# Altium project ADH_XC7Z010_SoC.PrjPcb (part 10 of 10)

## Sheet Gigabit_Ethernet.SchDoc: Gigabit Ethernet
size A3; DrawnBy: Emre Can Damyanlı; Revision: A.1; SheetNumber: 9; SheetTotal: 9; ENG_APP_DATE: --/--/--; DSN_APP_DATE: --/--/--; CHK_APP_DATE: --/--/--
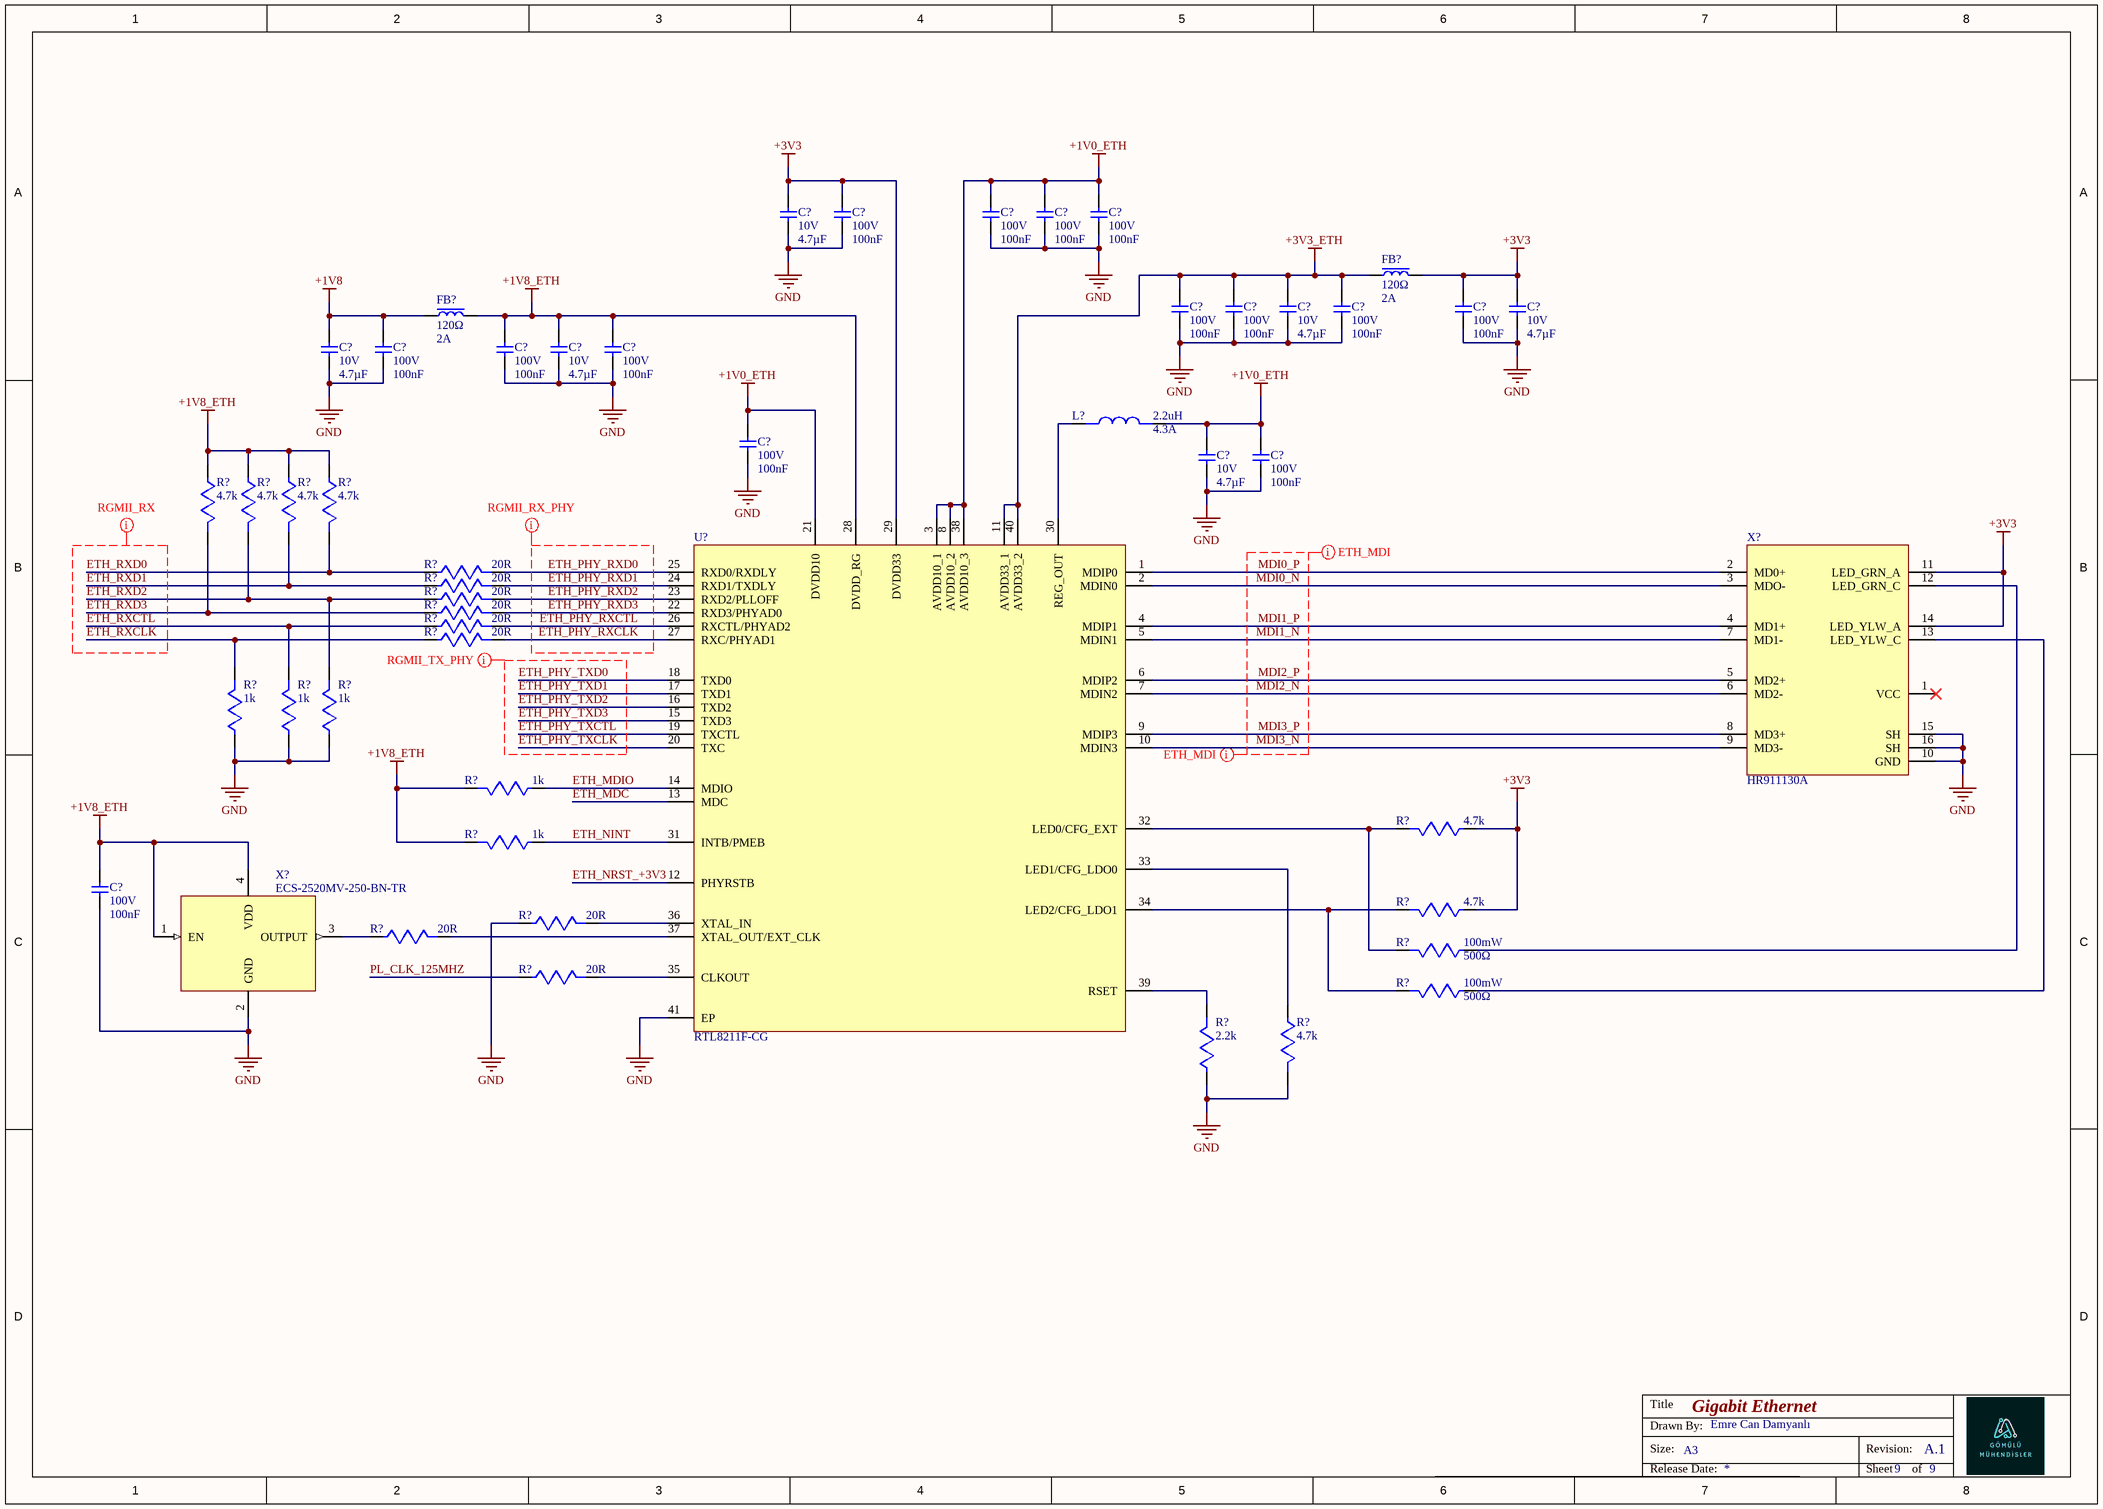
[diagram p8: Gigabit_Ethernet.SchDoc]

### Parts
(Parts that share a designator on the sheet are numbered #1, #2 ... from top to bottom, then left to right.)
C?#187  value 100nF  Voltage Rating: 100V  [CAPC1608X94N]  (hidden comment: GCJ188R72A104KA01D)
C?#188  value 100nF  Voltage Rating: 100V  [CAPC1608X94N]  (hidden comment: GCJ188R72A104KA01D)
C?#189  value 100nF  Voltage Rating: 100V  [CAPC1608X94N]  (hidden comment: GCJ188R72A104KA01D)
C?#190  value 100nF  Voltage Rating: 100V  [CAPC1608X94N]  (hidden comment: GCJ188R72A104KA01D)
C?#191  value 4.7µF  Voltage Rating: 10V  [CAPC1005X55N]  (hidden comment: CL05A475MP5NRNC)
C?#192  value 100nF  Voltage Rating: 100V  [CAPC1608X94N]  (hidden comment: GCJ188R72A104KA01D)
C?#193  value 100nF  Voltage Rating: 100V  [CAPC1608X94N]  (hidden comment: GCJ188R72A104KA01D)
C?#194  value 100nF  Voltage Rating: 100V  [CAPC1608X94N]  (hidden comment: GCJ188R72A104KA01D)
C?#195  value 100nF  Voltage Rating: 100V  [CAPC1608X94N]  (hidden comment: GCJ188R72A104KA01D)
C?#196  value 4.7µF  Voltage Rating: 10V  [CAPC1005X55N]  (hidden comment: CL05A475MP5NRNC)
C?#197  value 4.7µF  Voltage Rating: 10V  [CAPC1005X55N]  (hidden comment: CL05A475MP5NRNC)
C?#198  value 100nF  Voltage Rating: 100V  [CAPC1608X94N]  (hidden comment: GCJ188R72A104KA01D)
C?#199  value 100nF  Voltage Rating: 100V  [CAPC1608X94N]  (hidden comment: GCJ188R72A104KA01D)
C?#200  value 100nF  Voltage Rating: 100V  [CAPC1608X94N]  (hidden comment: GCJ188R72A104KA01D)
C?#201  value 4.7µF  Voltage Rating: 10V  [CAPC1005X55N]  (hidden comment: CL05A475MP5NRNC)
C?#202  value 4.7µF  Voltage Rating: 10V  [CAPC1005X55N]  (hidden comment: CL05A475MP5NRNC)
C?#203  value 100nF  Voltage Rating: 100V  [CAPC1608X94N]  (hidden comment: GCJ188R72A104KA01D)
C?#204  value 100nF  Voltage Rating: 100V  [CAPC1608X94N]  (hidden comment: GCJ188R72A104KA01D)
C?#205  value 4.7µF  Voltage Rating: 10V  [CAPC1005X55N]  (hidden comment: CL05A475MP5NRNC)
C?#206  value 100nF  Voltage Rating: 100V  [CAPC1608X94N]  (hidden comment: GCJ188R72A104KA01D)
FB?#5  Impedance: 120Ω  Max Current Rating: 2A  [FERRITE_0402]  (hidden comment: BLM15PX121SN1D)
FB?#6  Impedance: 120Ω  Max Current Rating: 2A  [FERRITE_0402]  (hidden comment: BLM15PX121SN1D)
L?#5  value 2.2uH  RMS Current (Irms): 4.3A  [PA4332.XXXNLT]  (hidden comment: PA4332.222NLT)
R?#136  value 4.7k  [RESISTOR_0603]  (hidden comment: RC0603FR-074K7L)
R?#137  value 4.7k  [RESISTOR_0603]  (hidden comment: RC0603FR-074K7L)
R?#138  value 4.7k  [RESISTOR_0603]  (hidden comment: RC0603FR-074K7L)
R?#139  value 4.7k  [RESISTOR_0603]  (hidden comment: RC0603FR-074K7L)
R?#140  value 20R  (hidden comment: RC0603FR-0720RL)
R?#141  value 20R  (hidden comment: RC0603FR-0720RL)
R?#142  value 20R  (hidden comment: RC0603FR-0720RL)
R?#143  value 20R  (hidden comment: RC0603FR-0720RL)
R?#144  value 20R  (hidden comment: RC0603FR-0720RL)
R?#145  value 20R  (hidden comment: RC0603FR-0720RL)
R?#146  value 1k  [RESISTOR_0603]  (hidden comment: RC0603FR-071KL)
R?#147  value 1k  [RESISTOR_0603]  (hidden comment: RC0603FR-071KL)
R?#148  value 1k  [RESISTOR_0603]  (hidden comment: RC0603FR-071KL)
R?#149  value 1k  [RESISTOR_0603]  (hidden comment: RC0603FR-071KL)
R?#150  value 4.7k  [RESISTOR_0603]  (hidden comment: RC0603FR-074K7L)
R?#151  value 1k  [RESISTOR_0603]  (hidden comment: RC0603FR-071KL)
R?#152  value 4.7k  [RESISTOR_0603]  (hidden comment: RC0603FR-074K7L)
R?#153  value 20R  (hidden comment: RC0603FR-0720RL)
R?#154  value 20R  (hidden comment: RC0603FR-0720RL)
R?#155  value 500Ω  Power Rating: 100mW  [RESISTOR_0603]  (hidden comment: RT0603BRC07500RL)
R?#156  value 20R  (hidden comment: RC0603FR-0720RL)
R?#157  value 500Ω  Power Rating: 100mW  [RESISTOR_0603]  (hidden comment: RT0603BRC07500RL)
R?#158  value 2.2k  [RESISTOR_0603]  (hidden comment: RC0603FR-072K2L)
R?#159  value 4.7k  [RESISTOR_0603]  (hidden comment: RC0603FR-074K7L)
U?#27  RTL8211F-CG  [QFN40P500X500X90-41N-D]
X?#3  HR911130A  [HR911130A]
X?#4  ECS-2520MV-250-BN-TR  [OSCCC250X200X90N]

### Nets
+1V0_ETH: C?#188.2 C?#189.2 C?#190.2 C?#203.2 C?#204.2 C?#205.2 L?#5.2 U?#27.3(AVDD10_1) U?#27.8(AVDD10_2) U?#27.21(DVDD10) U?#27.38(AVDD10_3)
+1V8: C?#198.2 C?#201.2 FB?#6.1
+1V8_ETH: C?#199.2 C?#200.2 C?#202.2 C?#206.2 FB?#6.2 R?#136.1 R?#137.1 R?#138.1 R?#139.1 R?#149.2 R?#151.2 U?#27.28(DVDD_RG) X?#4.1(EN) X?#4.4(VDD)
+3V3: C?#187.2 C?#191.2 C?#195.2 C?#197.2 FB?#5.1 R?#150.1 R?#152.1 U?#27.29(DVDD33) X?#3.11(LED_GRN_A) X?#3.14(LED_YLW_A)
+3V3_ETH: C?#192.2 C?#193.2 C?#194.2 C?#196.2 FB?#5.2 U?#27.11(AVDD33_1) U?#27.40(AVDD33_2)
GND: C?#187.1 C?#188.1 C?#189.1 C?#190.1 C?#191.1 C?#192.1 C?#193.1 C?#194.1 C?#195.1 C?#196.1 C?#197.1 C?#198.1 C?#199.1 C?#200.1 C?#201.1 C?#202.1 C?#203.1 C?#204.1 C?#205.1 C?#206.1 R?#146.1 R?#147.1 R?#148.1 R?#153.1 R?#158.1 R?#159.2 U?#27.41(EP) X?#3.10(GND) X?#3.15(SH) X?#3.16(SH) X?#4.2(GND)
ETH_MDC: U?#27.13(MDC)
ETH_MDIO: R?#149.1 U?#27.14(MDIO)
ETH_NINT: R?#151.1 U?#27.31(INTB/PMEB)
ETH_NRST_+3V3: U?#27.12(PHYRSTB)
ETH_PHY_RXCLK: R?#145.2 U?#27.27(RXC/PHYAD1)
ETH_PHY_RXCTL: R?#144.2 U?#27.26(RXCTL/PHYAD2)
ETH_PHY_RXD0: R?#140.2 U?#27.25(RXD0/RXDLY)
ETH_PHY_RXD1: R?#141.2 U?#27.24(RXD1/TXDLY)
ETH_PHY_RXD2: R?#142.2 U?#27.23(RXD2/PLLOFF)
ETH_PHY_RXD3: R?#143.2 U?#27.22(RXD3/PHYAD0)
ETH_PHY_TXCLK: U?#27.20(TXC)
ETH_PHY_TXCTL: U?#27.19(TXCTL)
ETH_PHY_TXD0: U?#27.18(TXD0)
ETH_PHY_TXD1: U?#27.17(TXD1)
ETH_PHY_TXD2: U?#27.16(TXD2)
ETH_PHY_TXD3: U?#27.15(TXD3)
ETH_RXCLK: R?#145.1 R?#146.2
ETH_RXCTL: R?#144.1 R?#147.2
ETH_RXD0: R?#139.2 R?#140.1
ETH_RXD1: R?#138.2 R?#141.1
ETH_RXD2: R?#137.2 R?#142.1 R?#148.2
ETH_RXD3: R?#136.2 R?#143.1
MDI0_N: U?#27.2(MDIN0) X?#3.3(MDO-)
MDI0_P: U?#27.1(MDIP0) X?#3.2(MD0+)
MDI1_N: U?#27.5(MDIN1) X?#3.7(MD1-)
MDI1_P: U?#27.4(MDIP1) X?#3.4(MD1+)
MDI2_N: U?#27.7(MDIN2) X?#3.6(MD2-)
MDI2_P: U?#27.6(MDIP2) X?#3.5(MD2+)
MDI3_N: U?#27.10(MDIN3) X?#3.9(MD3-)
MDI3_P: U?#27.9(MDIP3) X?#3.8(MD3+)
PL_CLK_125MHZ: R?#156.1
NetL?#5_1: L?#5.1 U?#27.30(REG_OUT)
NetR?#150_2: R?#150.2 R?#155.2 U?#27.32(LED0/CFG_EXT)
NetR?#152_2: R?#152.2 R?#157.2 U?#27.34(LED2/CFG_LDO1)
NetR?#153_2: R?#153.2 U?#27.36(XTAL_IN)
NetR?#154_1: R?#154.1 X?#4.3(OUTPUT)
NetR?#154_2: R?#154.2 U?#27.37(XTAL_OUT/EXT_CLK)
NetR?#155_1: R?#155.1 X?#3.12(LED_GRN_C)
NetR?#156_2: R?#156.2 U?#27.35(CLKOUT)
NetR?#157_1: R?#157.1 X?#3.13(LED_YLW_C)
NetR?#158_2: R?#158.2 U?#27.39(RSET)
NetR?#159_1: R?#159.1 U?#27.33(LED1/CFG_LDO0)

Not connected (* = marked no-connect by the designer): X?#3 1(VCC)*

### Layout directives
mark named ETH_MDI: MDI0_N, MDI0_P, MDI1_N, MDI1_P, MDI2_N, MDI2_P, MDI3_N, MDI3_P
differential pair: MDI0_N, MDI0_P, MDI1_N, MDI1_P, MDI2_N, MDI2_P, MDI3_N, MDI3_P
mark named RGMII_RX: ETH_RXCLK, ETH_RXCTL, ETH_RXD0, ETH_RXD1, ETH_RXD2, ETH_RXD3
mark named RGMII_RX_PHY: ETH_PHY_RXCLK, ETH_PHY_RXCTL, ETH_PHY_RXD0, ETH_PHY_RXD1, ETH_PHY_RXD2, ETH_PHY_RXD3
mark named RGMII_TX_PHY: ETH_PHY_TXCLK, ETH_PHY_TXCTL, ETH_PHY_TXD0, ETH_PHY_TXD1, ETH_PHY_TXD2, ETH_PHY_TXD3

### Notes on the sheet
- Title
- Size:
- Drawn By:
- A3
- Revision:
- Release Date:
- Sheet
- of

### Library data of the parts
C?#187-C?#190 C?#192-C?#195 C?#198-C?#200 C?#203 C?#204 C?#206 = GCJ188R72A104KA01D: as C?#116-C?#122 on sheet Zynq_PS_System; Supplier: Digikey; Supplier Part Number: 490-13420-1-ND; Manufacturer Part Number: GCJ188R72A104KA01D; RoHS: Yes; Category: Ceramic Capacitors; Stock: 681954; Pricing: 1=0,19, 10=0,123, 50=0,0774, 100=0,0619, 500=0,04472, 1000=0,03956 (USD); Mounting Technology: Surface Mount; Case/Package: 0603; Case Code (Metric): 1608; Case Code (Imperial): 0603; Min Operating Temperature: -55°C; Max Operating Temperature: 125°C; Packaging: Cut Tape; Tolerance: 10%; Features: Soft Termination; Series: GCJ; Length: 0.063inch; Width: 0.031inch; Height: 900um; Thickness: 0.035inch; Ratings: AEC-Q200; RoHS Compliant: Yes; Lead Free: 5697LeadFree; ComponentLink1URL: https://datasheet.octopart.com/GCJ188R72A104KA01D-Murata-datasheet-78375067.pdf?src-supplier=Future+Electronics; ComponentLink1Description: https://datasheet.octopart.com/GCJ188R72A104KA01D-Murata-datasheet-78375067.pdf?src-supplier=Future+Electronics; ComponentLink2URL: http://search.murata.co.jp/Ceramy/image/img/A01X/partnumbering_e_02.pdf?src-supplier=Digikey; ComponentLink2Description: http://search.murata.co.jp/Ceramy/image/img/A01X/partnumbering_e_02.pdf?src-supplier=Digikey; ComponentLink3URL: https://www.murata.com/~/media/webrenewal/support/library/catalog/products/capacitor/mlcc/c03e.ashx?la=en-us&src-supplier=Digikey; ComponentLink3Description: https://www.murata.com/~/media/webrenewal/support/library/catalog/products/capacitor/mlcc/c03e.ashx?la=en-us&src-supplier=Digikey; ComponentLink4URL: https://datasheet.octopart.com/GCJ188R72A104KA01D-Murata-datasheet-165611796.pdf?src-supplier=TME; ComponentLink4Description: https://datasheet.octopart.com/GCJ188R72A104KA01D-Murata-datasheet-165611796.pdf?src-supplier=TME
C?#191 C?#196 C?#197 C?#201 C?#202 C?#205 = CL05A475MP5NRNC: as C?#123-C?#125 on sheet Zynq_PS_System; Supplier: Avnet; Supplier Part Number: CL05A475MP5NRNC; Manufacturer Part Number: CL05A475MP5NRNC; RoHS: Compliant; Category: Ceramic Capacitors; Stock: 40000; Pricing: 10000=0,00671, 20000=0,00663, 40000=0,0066, 80000=0,00656, 160000=0,00653 (USD); Case/Package: 0402; Case Code (Imperial): 0402; Case Code (Metric): 1005; China RoHS: Compliant; Dielectric: X5R; Dielectric Material: Ceramic; Height: 500µm; Lead Free: Lead Free; Length: 1mm; Lifecycle Status: Production; Material: Ceramic; Max Operating Temperature: 85°C; Min Operating Temperature: -55°C; Mounting Technology: Surface Mount; Number of Terminals: 2; REACH SVHC: Yes; Schedule B: 8532240020, 8532240020|8532240020|8532240020|8532240020|8532240020|8532240020|8532240020|8532240020|8532240020|8532240020|8532240020|8532240020|8532240020|8532240020|8532240020|8532240020|8532240020|8532240020|8532240020|8532240020|8532240020|8532240020, 8532240020|8532240020|8532240020|8532240020|8532240020|8532240020|8532240020|8532240020|8532240020|8532240020|8532240020|8532240020|8532240020|8532240020|8532240020|8532240020|8532240020|8532240020|8532240020|8532240020|8532240020|8532240020|8532240020, 8532240020|8532240020|8532240020|8532240020|8532240020|8532240020|8532240020|8532240020|8532240020|8532240020|8532240020|8532240020|8532240020|8532240020|8532240020|8532240020|8532240020|8532240020|8532240020|8532240020|8532240020|8532240020|8532240020|85; Thickness: 558.8µm; Tolerance: 20%; Voltage Rating (DC): 10V; Width: 500µm; ComponentLink1URL: https://datasheet.octopart.com:443/CL05A475MP5NRNC-Samsung-Electro-Mechanics-datasheet-181551186.pdf?src-supplier=Newark; ComponentLink1Description: https://datasheet.octopart.com:443/CL05A475MP5NRNC-Samsung-Electro-Mechanics-datasheet-181551186.pdf?src-supplier=Newark; ComponentLink2URL: https://datasheet.octopart.com:443/CL05A475MP5NRNC-Samsung-Electro-Mechanics-datasheet-136482298.pdf?src-supplier=Newark; ComponentLink2Description: https://datasheet.octopart.com:443/CL05A475MP5NRNC-Samsung-Electro-Mechanics-datasheet-136482298.pdf?src-supplier=Newark; ComponentLink3URL: https://datasheet.octopart.com:443/CL05A475MP5NRNC-Samsung-Electro-Mechanics-datasheet-136031736.pdf?src-supplier=Future+Electronics; ComponentLink3Description: https://datasheet.octopart.com:443/CL05A475MP5NRNC-Samsung-Electro-Mechanics-datasheet-136031736.pdf?src-supplier=Future+Electronics; ComponentLink4URL: https://datasheet.octopart.com:443/CL05A475MP5NRNC-Samsung-Electro-Mechanics-datasheet-110226226.pdf?src-supplier=Future+Electronics; ComponentLink4Description: https://datasheet.octopart.com:443/CL05A475MP5NRNC-Samsung-Electro-Mechanics-datasheet-110226226.pdf?src-supplier=Future+Electronics; ComponentLink5URL: https://datasheet.octopart.com:443/CL05A475MP5NRNC-Samsung-Electro-Mechanics-datasheet-87580058.pdf?src-supplier=Future+Electronics; ComponentLink5Description: https://datasheet.octopart.com:443/CL05A475MP5NRNC-Samsung-Electro-Mechanics-datasheet-87580058.pdf?src-supplier=Future+Electronics; ComponentLink6URL: https://datasheet.octopart.com:443/CL05A475MP5NRNC-Samsung-Electro-Mechanics-datasheet-81461611.pdf?src-supplier=Future+Electronics; ComponentLink6Description: https://datasheet.octopart.com:443/CL05A475MP5NRNC-Samsung-Electro-Mechanics-datasheet-81461611.pdf?src-supplier=Future+Electronics; ComponentLink7URL: https://datasheet.octopart.com:443/CL05A475MP5NRNC-Samsung-datasheet-48647200.pdf?src-supplier=Future+Electronics; ComponentLink7Description: https://datasheet.octopart.com:443/CL05A475MP5NRNC-Samsung-datasheet-48647200.pdf?src-supplier=Future+Electronics; ComponentLink8URL: https://datasheet.octopart.com:443/CL05A475MP5NRNC-Samsung-datasheet-34153549.pdf?src-supplier=Future+Electronics; ComponentLink8Description: https://datasheet.octopart.com:443/CL05A475MP5NRNC-Samsung-datasheet-34153549.pdf?src-supplier=Future+Electronics; ComponentLink9URL: https://datasheet.octopart.com:443/CL05A475MP5NRNC-Samsung-datasheet-26589015.pdf?src-supplier=Future+Electronics; ComponentLink9Description: https://datasheet.octopart.com:443/CL05A475MP5NRNC-Samsung-datasheet-26589015.pdf?src-supplier=Future+Electronics; ComponentLink10URL: https://datasheet.octopart.com:443/CL05A475MP5NRNC-Samsung-datasheet-8324245.pdf?src-supplier=Future+Electronics; ComponentLink10Description: https://datasheet.octopart.com:443/CL05A475MP5NRNC-Samsung-datasheet-8324245.pdf?src-supplier=Future+Electronics; ComponentLink11URL: https://datasheet.octopart.com:443/CL05A475MP5NRNC-Samsung-Electro-Mechanics-datasheet-149136695.pdf?src-supplier=Future+Electronics; ComponentLink11Description: https://datasheet.octopart.com:443/CL05A475MP5NRNC-Samsung-Electro-Mechanics-datasheet-149136695.pdf?src-supplier=Future+Electronics; ComponentLink12URL: https://datasheet.octopart.com:443/CL05A475MP5NRNC-Samsung-datasheet-8326407.pdf?src-supplier=TME; ComponentLink12Description: https://datasheet.octopart.com:443/CL05A475MP5NRNC-Samsung-datasheet-8326407.pdf?src-supplier=TME
FB?#5 FB?#6 = BLM15PX121SN1D: Ferrite Beads Multi-Layer 120Ohm 25% 100MHz 2A 0.055Ohm DCR 0402 T/R; Manufacturer: Murata; Current Rating: 1.1A; DC Resistance (DCR): 55mΩ; Material: Steel; Number of Circuits: 1; Supplier: Arrow Electronics; Supplier Part Number: BLM15PX121SN1D; Manufacturer Part Number: BLM15PX121SN1D; RoHS: Compliant; Category: Ferrite Beads and Chips; Stock: 81241; Pricing: 4237=0,0236, 6000=0,023, 15000=0,023, 30000=0,022, 75000=0,022 (USD); Case/Package: 0402; Case Code (Imperial): 0402; Case Code (Metric): 1005; Contact Plating: Tin; Core Material: Ferrite; Height: 500µm; Lead Free: Lead Free; Length: 1mm; Lifecycle Status: Production; Max DC Current: 2A; Max Operating Temperature: 125°C; Min Operating Temperature: -55°C; Number of Lines: 1; Pins: 2; Number of Terminals: 2; Packaging: Tape and Reel; REACH SVHC: Yes; RMS Current (Irms): 2A; Schedule B: 8504500000, 8504500000|8504500000, 8504500000|8504500000|8504500000, 8504500000|8504500000|8504500000|8504500000; ESR: 55mΩ; Termination: SMD/SMT; Test Frequency: 100MHz; Tolerance: 25%; Weight: 652.039032µg; Width: 500µm; ComponentLink1URL: https://datasheet.octopart.com:443/BLM15PX121SN1D-Murata-datasheet-180806543.pdf?src-supplier=IHS; ComponentLink1Description: https://datasheet.octopart.com:443/BLM15PX121SN1D-Murata-datasheet-180806543.pdf?src-supplier=IHS; ComponentLink2URL: https://datasheet.octopart.com:443/BLM15PX121SN1D-Murata-datasheet-12522583.pdf?src-supplier=Upverter; ComponentLink2Description: https://datasheet.octopart.com:443/BLM15PX121SN1D-Murata-datasheet-12522583.pdf?src-supplier=Upverter; ComponentLink3URL: https://datasheet.octopart.com:443/BLM15PX121SN1D-Murata-datasheet-10083551.pdf?src-supplier=Upverter; ComponentLink3Description: https://datasheet.octopart.com:443/BLM15PX121SN1D-Murata-datasheet-10083551.pdf?src-supplier=Upverter; ComponentLink4URL: https://datasheet.octopart.com:443/BLM15PX121SN1D-Murata-datasheet-8508678.pdf?src-supplier=Upverter; ComponentLink4Description: https://datasheet.octopart.com:443/BLM15PX121SN1D-Murata-datasheet-8508678.pdf?src-supplier=Upverter; ComponentLink5URL: https://datasheet.octopart.com:443/BLM15PX121SN1D-Murata-datasheet-39128427.pdf?src-supplier=Newark; ComponentLink5Description: https://datasheet.octopart.com:443/BLM15PX121SN1D-Murata-datasheet-39128427.pdf?src-supplier=Newark; ComponentLink6URL: https://datasheet.octopart.com:443/BLM15PX121SN1D-Murata-datasheet-166171473.pdf?src-supplier=TME; ComponentLink6Description: https://datasheet.octopart.com:443/BLM15PX121SN1D-Murata-datasheet-166171473.pdf?src-supplier=TME; ComponentLink7URL: https://datasheet.octopart.com:443/BLM15PX121SN1D-Murata-datasheet-141257890.pdf?src-supplier=Ciiva; ComponentLink7Description: https://datasheet.octopart.com:443/BLM15PX121SN1D-Murata-datasheet-141257890.pdf?src-supplier=Ciiva; ComponentLink8URL: https://datasheet.octopart.com:443/BLM15PX121SN1D-Murata-datasheet-138706708.pdf?src-supplier=Ciiva; ComponentLink8Description: https://datasheet.octopart.com:443/BLM15PX121SN1D-Murata-datasheet-138706708.pdf?src-supplier=Ciiva; ComponentLink9URL: https://datasheet.octopart.com:443/BLM15PX121SN1D-Murata-datasheet-78375072.pdf?src-supplier=Future+Electronics; ComponentLink9Description: https://datasheet.octopart.com:443/BLM15PX121SN1D-Murata-datasheet-78375072.pdf?src-supplier=Future+Electronics; ComponentLink10URL: https://datasheet.octopart.com:443/BLM15PX121SN1D-Murata-datasheet-13563506.pdf?src-supplier=Future+Electronics; ComponentLink10Description: https://datasheet.octopart.com:443/BLM15PX121SN1D-Murata-datasheet-13563506.pdf?src-supplier=Future+Electronics; ComponentLink11URL: https://datasheet.octopart.com:443/BLM15PX121SN1D-Murata-datasheet-12545319.pdf?src-supplier=Future+Electronics; ComponentLink11Description: https://datasheet.octopart.com:443/BLM15PX121SN1D-Murata-datasheet-12545319.pdf?src-supplier=Future+Electronics; ComponentLink12URL: https://datasheet.octopart.com/BLM15PX121SN1D-Murata-datasheet-37129980.pdf; ComponentLink12Description: https://datasheet.octopart.com/BLM15PX121SN1D-Murata-datasheet-37129980.pdf; ComponentLink13URL: http://sigma.octopart.com:80/reach_statement/Murata-company-16.pdf?src-supplier=Compliance+Statements; ComponentLink13Description: http://sigma.octopart.com:80/reach_statement/Murata-company-16.pdf?src-supplier=Compliance+Statements
L?#5 = PA4332.222NLT: PA4332 SMT Shielded Drum Core Inductor Series, up to 5.8A, 2.0mm Max Height; Manufacturer: Pulse; ESR: 48mR; Supplier: Digikey; Supplier Part Number: 553-3290-1-ND; Manufacturer Part Number: PA4332.222NLT; RoHS: Yes; Category: Fixed Inductors; Stock: 54159; Pricing: 1=0,56, 10=0,477, 25=0,4376, 50=0,3976, 100=0,3539, 250=0,33404, 500=0,28634, 1000=0,25452 (USD); Height: 2mm; ComponentLink1URL: http://products.pulseelex.com/files/product_files/P761.pdf?src-supplier=Digikey; ComponentLink1Description: http://products.pulseelex.com/files/product_files/P761.pdf?src-supplier=Digikey; ComponentLink2URL: https://datasheet.octopart.com/PA4332.222NLT-Pulse-datasheet-137333238.pdf?src-supplier=Electro+Sonic; ComponentLink2Description: https://datasheet.octopart.com/PA4332.222NLT-Pulse-datasheet-137333238.pdf?src-supplier=Electro+Sonic
R?#136-R?#139 R?#150 R?#152 R?#159 = RC0603FR-074K7L: SMD Chip Resistor, 4.7 kOhm, ± 1%, 100 mW, 0603 [1608 Metric], Thick Film, General Purpose; Manufacturer: Yageo; Power Rating: 100mW; Voltage Rating (DC): 50V; Temperature Coefficient: 100ppm/°C; Supplier: Digi-Key; Supplier Part Number: 311-4.70KHRCT-ND; Manufacturer Part Number: RC0603FR-074K7L; RoHS: Yes; Category: Chip SMD Resistors; Stock: 7233601; Pricing: 1=0,1, 10=0,018, 50=0,0106, 100=0,0088, 500=0,00592, 1000=0,00505 (USD); Case/Package: 0603; Pins: 2; Case Code (Imperial): 0603; Case Code (Metric): 1608; Min Operating Temperature: -55°C; Max Operating Temperature: 155°C; Tolerance: 1%; Resistor Type: Thick Film; Packaging: Tape and Reel; Voltage Rating: 50V; Termination: SMD/SMT; Features: Moisture Resistant; Series: RC; Max Power Dissipation: 100mW; Number of Terminations: 2; Construction: Rectangular; Resistance Tolerance: 1%; Length: 1.6mm; Width: 0.8mm; Depth: 0.8mm; Lead Pitch: 0.3mm; Lead Free: Lead Free; Reach SVHC Compliant: Unknown; RoHS Compliant: Yes; Military Standard: Not; ComponentLink1URL: https://datasheet.ciiva.com/15189/getdatasheetpartid-422754-15189760.pdf?src-supplier=Verical; ComponentLink1Description: https://datasheet.ciiva.com/15189/getdatasheetpartid-422754-15189760.pdf?src-supplier=Verical; ComponentLink2URL: https://datasheet.ciiva.com/7660/38590-7660794.pdf?src-supplier=Element14; ComponentLink2Description: https://datasheet.ciiva.com/7660/38590-7660794.pdf?src-supplier=Element14; ComponentLink3URL: https://datasheet.ciiva.com/22747/443971-22747528.pdf?src-supplier=Element14; ComponentLink3Description: https://datasheet.ciiva.com/22747/443971-22747528.pdf?src-supplier=Element14; ComponentLink4URL: https://datasheet.ciiva.com/46440/1868787-46440909.pdf?src-supplier=Element14; ComponentLink4Description: https://datasheet.ciiva.com/46440/1868787-46440909.pdf?src-supplier=Element14; ComponentLink5URL: https://datasheet.ciiva.com/7746/1868787-7746365.pdf?src-supplier=Element14; ComponentLink5Description: https://datasheet.ciiva.com/7746/1868787-7746365.pdf?src-supplier=Element14; ComponentLink6URL: https://datasheet.ciiva.com/7746/1738695-7746366.pdf?src-supplier=Element14; ComponentLink6Description: https://datasheet.ciiva.com/7746/1738695-7746366.pdf?src-supplier=Element14
R?#140-R?#145 R?#153 R?#154 R?#156 = RC0603FR-0720RL: SMD Chip Resistor, 20 Ohm, ± 1%, 100 mW, 0603 [1608 Metric], Thick Film, General Purpose; Manufacturer: Yageo; Power Rating: 100mW; Voltage Rating: 50V; Temperature Coefficient: 100ppm/°C; Working Voltage: 75V; Supplier: Digi-Key; Supplier Part Number: 311-20.0HRCT-ND; Manufacturer Part Number: RC0603FR-0720RL; RoHS: Yes; Category: Chip SMD Resistors; Stock: 293682; Pricing: 1=0,1, 10=0,018, 50=0,0106, 100=0,0088, 500=0,00592, 1000=0,00505 (USD); Case/Package: 0603; Case Code (Imperial): 0603; Case Code (Metric): 1608; Min Operating Temperature: -55°C; Max Operating Temperature: 155°C; Tolerance: 1%; Packaging: Tape and Reel; Package Quantity: 5000; Termination: SMD/SMT; Resistor Type: Thick Film; Number of Terminations: 2; Max Power Dissipation: 100mW; Voltage Rating (DC): 50V; Features: Moisture Resistant; Series: RC; Construction: Rectangular; Technology: THICK FILM; Resistance Tolerance: 1%; Length: 1.6mm; Width: 0.031inch; Height: 0.45mm; Depth: 0.8mm; Reach SVHC Compliant: No; Military Standard: Not; Lead Free: Lead Free; RoHS Compliant: Yes; ComponentLink1URL: https://datasheet.ciiva.com/11819/0900766b80f96399-11819290.pdf?src-supplier=Rs; ComponentLink1Description: https://datasheet.ciiva.com/11819/0900766b80f96399-11819290.pdf?src-supplier=Rs; ComponentLink2URL: https://datasheet.ciiva.com/46395/443971-46395031.pdf?src-supplier=Element14; ComponentLink2Description: https://datasheet.ciiva.com/46395/443971-46395031.pdf?src-supplier=Element14; ComponentLink3URL: https://datasheet.ciiva.com/2454/pyu-r-int-thick-7-2454028.pdf?src-supplier=Digi-Key; ComponentLink3Description: https://datasheet.ciiva.com/2454/pyu-r-int-thick-7-2454028.pdf?src-supplier=Digi-Key; ComponentLink4URL: https://datasheet.ciiva.com/2454/pyu-r-int-thick-7-2454029.pdf?src-supplier=Digi-Key; ComponentLink4Description: https://datasheet.ciiva.com/2454/pyu-r-int-thick-7-2454029.pdf?src-supplier=Digi-Key; ComponentLink5URL: https://datasheet.ciiva.com/2454/pyu-r-int-thick-7-2454027.pdf?src-supplier=Digi-Key; ComponentLink5Description: https://datasheet.ciiva.com/2454/pyu-r-int-thick-7-2454027.pdf?src-supplier=Digi-Key; ComponentLink6URL: https://datasheet.ciiva.com/12557/rc0603-272842-12557941.pdf?src-supplier=Mouser; ComponentLink6Description: https://datasheet.ciiva.com/12557/rc0603-272842-12557941.pdf?src-supplier=Mouser; ComponentLink7URL: https://datasheet.ciiva.com/15189/getdatasheetpartid-324013-15189653.pdf?src-supplier=Verical; ComponentLink7Description: https://datasheet.ciiva.com/15189/getdatasheetpartid-324013-15189653.pdf?src-supplier=Verical
R?#146-R?#149 R?#151 = RC0603FR-071KL: SMD Chip Resistor, 1 kOhm, ± 1%, 100 mW, 0603 [1608 Metric], Thick Film, General Purpose; Manufacturer: Yageo; Temperature Coefficient: 100ppm/°C; Power Rating: 100mW; Voltage Rating: 50V; Supplier: Digi-Key; Supplier Part Number: 311-1.00KHRCT-ND; Manufacturer Part Number: RC0603FR-071KL; RoHS: Yes; Category: Chip SMD Resistors; Stock: 18662657; Pricing: 1=0,1, 10=0,018, 50=0,0106, 100=0,0088, 500=0,00592, 1000=0,00505 (USD); Case/Package: 0603; Contact Plating: Tin,Matte; Case Code (Imperial): 0603; Case Code (Metric): 1608; Min Operating Temperature: -55°C; Max Operating Temperature: 155°C; Tolerance: 1%; Resistor Type: Thick Film; Packaging: Tape and Reel; Termination: SMD/SMT; Features: Moisture Resistant; Series: RC; Max Power Dissipation: 100mW; Number of Terminations: 2; Technology: THICK FILM; Resistance Tolerance: 1%; Construction: Rectangular; Length: 1.6mm; Height: 0.45mm; Depth: 0.8mm; Reach SVHC Compliant: No; Military Standard: Not; RoHS Compliant: Yes
R?#155 R?#157 = RT0603BRC07500RL: Fixed Resistor, Thin Film, 0.1W, 500ohm, 75V, 0.1% +/-Tol, 15ppm/Cel, Surface Mount, 0603; Manufacturer: Yageo Group; Temperature Coefficient: 15ppm/°C; Supplier: Farnell; Supplier Part Number: 4152629; Manufacturer Part Number: RT0603BRC07500RL; RoHS: Compliant; Category: Chip SMD Resistors; Stock: 4870; Pricing: 5000=0,12 (EUR); Case/Package: 0603; China RoHS: Non-Compliant; Composition: Thin Film; Height: 450µm; Lifecycle Status: Production; Max Operating Temperature: 155°C; Min Operating Temperature: -55°C; Mounting Technology: Surface Mount; Number of Terminals: 2; Packaging: Tape & Reel; Power Dissipation: 100mW; REACH SVHC: Yes; Tolerance: 0.1%; Voltage Rating: 75V; Width: 800µm; Working Voltage: 75V; ComponentLink1URL: https://datasheet.octopart.com:443/RT0603BRC07500RL-Yageo-datasheet-176402239.pdf?src-supplier=IHS; ComponentLink1Description: https://datasheet.octopart.com:443/RT0603BRC07500RL-Yageo-datasheet-176402239.pdf?src-supplier=IHS; ComponentLink2URL: https://datasheet.octopart.com:443/RT0603BRC07500RL-Yageo-datasheet-141265893.pdf?src-supplier=ODG+(Origin+Data+Global); ComponentLink2Description: https://datasheet.octopart.com:443/RT0603BRC07500RL-Yageo-datasheet-141265893.pdf?src-supplier=ODG+(Origin+Data+Global); ComponentLink3URL: https://datasheet.octopart.com:443/RT0603BRC07500RL-Yageo-datasheet-169971040.pdf?src-supplier=Upverter; ComponentLink3Description: https://datasheet.octopart.com:443/RT0603BRC07500RL-Yageo-datasheet-169971040.pdf?src-supplier=Upverter; ComponentLink4URL: https://datasheet.octopart.com:443/RT0603BRC07500RL-Yageo-datasheet-166250672.pdf?src-supplier=Future+Electronics; ComponentLink4Description: https://datasheet.octopart.com:443/RT0603BRC07500RL-Yageo-datasheet-166250672.pdf?src-supplier=Future+Electronics; ComponentLink5URL: https://datasheet.octopart.com/RT0603BRC07500RL-Yageo-datasheet-86813807.pdf; ComponentLink5Description: https://datasheet.octopart.com/RT0603BRC07500RL-Yageo-datasheet-86813807.pdf; ComponentLink6URL: http://sigma.octopart.com:80/rohs_statement/Yageo-company-2.pdf?src-supplier=Compliance+Statements; ComponentLink6Description: http://sigma.octopart.com:80/rohs_statement/Yageo-company-2.pdf?src-supplier=Compliance+Statements; ComponentLink7URL: http://sigma.octopart.com:80/conflict_mineral_statement/Yageo-company-3.pdf?src-supplier=Compliance+Statements; ComponentLink7Description: http://sigma.octopart.com:80/conflict_mineral_statement/Yageo-company-3.pdf?src-supplier=Compliance+Statements
R?#158 = RC0603FR-072K2L: SMD Chip Resistor, 2.2 kOhm, ± 1%, 100 mW, 0603 [1608 Metric], Thick Film, General Purpose; Manufacturer: Yageo; Temperature Coefficient: 100ppm/°C; Power Rating: 100mW; Voltage Rating: 50V; Supplier: Digi-Key; Supplier Part Number: 311-2.20KHRCT-ND; Manufacturer Part Number: RC0603FR-072K2L; RoHS: Yes; Category: Chip SMD Resistors; Stock: 709886; Pricing: 1=0,1, 10=0,019, 50=0,0112, 100=0,0093, 500=0,00622, 1000=0,00532 (USD); Case/Package: 0603; Case Code (Imperial): 0603; Case Code (Metric): 1608; Min Operating Temperature: -55°C; Max Operating Temperature: 155°C; Tolerance: 1%; Packaging: Tape and Reel; Resistor Type: Thick Film; Number of Terminations: 2; Max Power Dissipation: 100mW; Features: Moisture Resistant; Series: RC; Resistance Tolerance: 1%; Lead Free: Lead Free; Reach SVHC Compliant: Unknown; RoHS Compliant: Yes
U?#27 = RTL8211F-CG: Ethernet Transceiver RGMII WQFN-40-EP(5x5) Drivers, Receivers, Transceivers RoHS; Manufacturer Part Number: RTL8211F-CG
X?#3 = HR911130A: Jack Modular Connector RJ45 Through Hole; Manufacturer Part Number: HR911130A
X?#4 = ECS-2520MV-250-BN-TR: ECS-2520 Series 25 MHz 1.6 to 3.6 V ±50 ppm-40°C to 85°C SMT Crystal Oscillator; Manufacturer: ECS International; Body Material: Ceramic; Fall Time: 7ns; Frequency: 25MHz; Frequency Stability: 50ppm; Load Capacitance: 15pF; Max Supply Current: 7mA; Max Supply Voltage: 3.6V; Min Supply Voltage: 1.6V; Supplier: Future Electronics; Supplier Part Number: ECS-2520MV-250-BN-TR; Manufacturer Part Number: ECS-2520MV-250-BN-TR; RoHS: Compliant; Category: Crystals; Stock: 21000; Pricing: 3000=0,61 (USD); Introduction Date: 2018-03-21; Lifecycle Status: Production; Max Operating Temperature: 85°C; Min Operating Temperature: -40°C; Mounting Technology: Surface Mount; Number of Terminals: 4; REACH SVHC: Yes; Rise Time: 7ns; Schedule B: 8542310000, 8542310000|8542310000|8542310000|8542310000|8542310000|8542310000|8542310000|8542310000|8542310000|8542310000|8542310000|8542310000|8542310000|8542310000|8542310000|8542310000|8542310000|8542310000|8542310000|8542310000|8542310000|8542310000|8542310000|85, 8542390000; ComponentLink1URL: https://datasheet.octopart.com:443/ECS-2520MV-250-BN-TR-ECS-International-datasheet-179230857.pdf?src-supplier=IHS; ComponentLink1Description: https://datasheet.octopart.com:443/ECS-2520MV-250-BN-TR-ECS-International-datasheet-179230857.pdf?src-supplier=IHS; ComponentLink2URL: https://datasheet.octopart.com:443/ECS-2520MV-250-BN-TR-ECS-International-datasheet-104167383.pdf?src-supplier=Master+Electronics; ComponentLink2Description: https://datasheet.octopart.com:443/ECS-2520MV-250-BN-TR-ECS-International-datasheet-104167383.pdf?src-supplier=Master+Electronics; ComponentLink3URL: https://datasheet.octopart.com:443/ECS-2520MV-250-BN-TR-ECS-International-datasheet-189099886.pdf?src-supplier=Master+Electronics; ComponentLink3Description: https://datasheet.octopart.com:443/ECS-2520MV-250-BN-TR-ECS-International-datasheet-189099886.pdf?src-supplier=Master+Electronics; ComponentLink4URL: https://datasheet.octopart.com:443/ECS-2520MV-250-BN-TR-ECS-International-datasheet-138123782.pdf?src-supplier=Future+Electronics; ComponentLink4Description: https://datasheet.octopart.com:443/ECS-2520MV-250-BN-TR-ECS-International-datasheet-138123782.pdf?src-supplier=Future+Electronics

## Nets that join several sheets
+0V675: Regulators (5 pins), Zynq_DDR_Interface (36 pins)
+0V675_REF: Regulators (C?#44.2 C?#45.2 U?#6.6), Zynq_DDR_Interface (C?#141.2 C?#142.2 U?#22.H6 U?#22.P6), DDR3L_Modules (8 pins)
+1V0: Regulators (5 pins), Zynq_Power (29 pins)
+1V8: Regulators (5 pins), Zynq_Power (29 pins), Zynq_PS_System (R?#78.2 R?#80.1), Gigabit_Ethernet (C?#198.2 C?#201.2 FB?#6.1)
+1V35: Regulators (9 pins), Zynq_Power (16 pins), Zynq_DDR_Interface (R?#132.1), DDR3L_Modules (78 pins)
+3V3: Regulators (9 pins), Zynq_Power (40 pins), Zynq_JTAG_Programmer (36 pins), Zynq_PS_System (34 pins), Zynq_PL (R?#102.2 R?#103.2), Gigabit_Ethernet (10 pins)
+5V: Input_Power (FB?#1.2), Regulators (26 pins), Zynq_JTAG_Programmer (R?#50.2)
GND: Input_Power (21 pins), Regulators (51 pins), Zynq_Power (110 pins), Zynq_JTAG_Programmer (51 pins), Zynq_PS_System (35 pins), Zynq_PL (Q?#7.2 R?#105.1), Zynq_DDR_Interface (16 pins), DDR3L_Modules (86 pins), Gigabit_Ethernet (31 pins)
DDR_A0: Zynq_DDR_Interface (R?#115.1 U?#22.N2), DDR3L_Modules (U?#24.N3 U?#26.N3)
DDR_A1: Zynq_DDR_Interface (R?#116.1 U?#22.K2), DDR3L_Modules (U?#24.P7 U?#26.P7)
DDR_A2: Zynq_DDR_Interface (R?#117.1 U?#22.M3), DDR3L_Modules (U?#24.P3 U?#26.P3)
DDR_A3: Zynq_DDR_Interface (R?#118.1 U?#22.K3), DDR3L_Modules (U?#24.N2 U?#26.N2)
DDR_A4: Zynq_DDR_Interface (R?#119.1 U?#22.M4), DDR3L_Modules (U?#24.P8 U?#26.P8)
DDR_A5: Zynq_DDR_Interface (R?#120.1 U?#22.L1), DDR3L_Modules (U?#24.P2 U?#26.P2)
DDR_A6: Zynq_DDR_Interface (R?#121.1 U?#22.L4), DDR3L_Modules (U?#24.R8 U?#26.R8)
DDR_A7: Zynq_DDR_Interface (R?#122.1 U?#22.K4), DDR3L_Modules (U?#24.R2 U?#26.R2)
DDR_A8: Zynq_DDR_Interface (R?#123.1 U?#22.K1), DDR3L_Modules (U?#24.T8 U?#26.T8)
DDR_A9: Zynq_DDR_Interface (R?#124.1 U?#22.J4), DDR3L_Modules (U?#24.R3 U?#26.R3)
DDR_A10: Zynq_DDR_Interface (R?#125.1 U?#22.F5), DDR3L_Modules (U?#24.L7 U?#26.L7)
DDR_A11: Zynq_DDR_Interface (R?#126.1 U?#22.G4), DDR3L_Modules (U?#24.R7 U?#26.R7)
DDR_A12: Zynq_DDR_Interface (R?#127.1 U?#22.E4), DDR3L_Modules (U?#24.N7 U?#26.N7)
DDR_A13: Zynq_DDR_Interface (R?#128.1 U?#22.D4), DDR3L_Modules (U?#24.T3 U?#26.T3)
DDR_A14: Zynq_DDR_Interface (R?#129.1 U?#22.F4), DDR3L_Modules (U?#24.T7 U?#26.T7)
DDR_BA0: Zynq_DDR_Interface (R?#112.1 U?#22.L5), DDR3L_Modules (U?#24.M2 U?#26.M2)
DDR_BA1: Zynq_DDR_Interface (R?#113.1 U?#22.R4), DDR3L_Modules (U?#24.N8 U?#26.N8)
DDR_BA2: Zynq_DDR_Interface (R?#114.1 U?#22.J5), DDR3L_Modules (U?#24.M3 U?#26.M3)
DDR_CK_N: Zynq_DDR_Interface (R?#106.1 U?#22.M2), DDR3L_Modules (U?#24.K7 U?#26.K7)
DDR_CK_P: Zynq_DDR_Interface (R?#106.2 U?#22.L2), DDR3L_Modules (U?#24.J7 U?#26.J7)
DDR_CKE: Zynq_DDR_Interface (R?#107.1 U?#22.N3), DDR3L_Modules (U?#24.K9 U?#26.K9)
DDR_DM0: Zynq_DDR_Interface (U?#22.A1), DDR3L_Modules (U?#24.D3)
DDR_DM1: Zynq_DDR_Interface (U?#22.F1), DDR3L_Modules (U?#24.E7)
DDR_DM2: Zynq_DDR_Interface (U?#22.T1), DDR3L_Modules (U?#26.E7)
DDR_DM3: Zynq_DDR_Interface (U?#22.Y1), DDR3L_Modules (U?#26.D3)
DDR_DQ0: Zynq_DDR_Interface (U?#22.C3), DDR3L_Modules (U?#24.A3)
DDR_DQ1: Zynq_DDR_Interface (U?#22.B3), DDR3L_Modules (U?#24.C3)
DDR_DQ2: Zynq_DDR_Interface (U?#22.A2), DDR3L_Modules (U?#24.C2)
DDR_DQ3: Zynq_DDR_Interface (U?#22.A4), DDR3L_Modules (U?#24.A2)
DDR_DQ4: Zynq_DDR_Interface (U?#22.D3), DDR3L_Modules (U?#24.B8)
DDR_DQ5: Zynq_DDR_Interface (U?#22.D1), DDR3L_Modules (U?#24.D7)
DDR_DQ6: Zynq_DDR_Interface (U?#22.C1), DDR3L_Modules (U?#24.A7)
DDR_DQ7: Zynq_DDR_Interface (U?#22.E1), DDR3L_Modules (U?#24.C8)
DDR_DQ8: Zynq_DDR_Interface (U?#22.E2), DDR3L_Modules (U?#24.H3)
DDR_DQ9: Zynq_DDR_Interface (U?#22.E3), DDR3L_Modules (U?#24.E3)
DDR_DQ10: Zynq_DDR_Interface (U?#22.G3), DDR3L_Modules (U?#24.G2)
DDR_DQ11: Zynq_DDR_Interface (U?#22.H3), DDR3L_Modules (U?#24.H7)
DDR_DQ12: Zynq_DDR_Interface (U?#22.J3), DDR3L_Modules (U?#24.F7)
DDR_DQ13: Zynq_DDR_Interface (U?#22.H2), DDR3L_Modules (U?#24.H8)
DDR_DQ14: Zynq_DDR_Interface (U?#22.H1), DDR3L_Modules (U?#24.F2)
DDR_DQ15: Zynq_DDR_Interface (U?#22.J1), DDR3L_Modules (U?#24.F8)
DDR_DQ16: Zynq_DDR_Interface (U?#22.P1), DDR3L_Modules (U?#26.E3)
DDR_DQ17: Zynq_DDR_Interface (U?#22.P3), DDR3L_Modules (U?#26.H3)
DDR_DQ18: Zynq_DDR_Interface (U?#22.R3), DDR3L_Modules (U?#26.G2)
DDR_DQ19: Zynq_DDR_Interface (U?#22.R1), DDR3L_Modules (U?#26.F2)
DDR_DQ20: Zynq_DDR_Interface (U?#22.T4), DDR3L_Modules (U?#26.F7)
DDR_DQ21: Zynq_DDR_Interface (U?#22.U4), DDR3L_Modules (U?#26.F8)
DDR_DQ22: Zynq_DDR_Interface (U?#22.U2), DDR3L_Modules (U?#26.H8)
DDR_DQ23: Zynq_DDR_Interface (U?#22.U3), DDR3L_Modules (U?#26.H7)
DDR_DQ24: Zynq_DDR_Interface (U?#22.V1), DDR3L_Modules (U?#26.A2)
DDR_DQ25: Zynq_DDR_Interface (U?#22.Y3), DDR3L_Modules (U?#26.C8)
DDR_DQ26: Zynq_DDR_Interface (U?#22.W1), DDR3L_Modules (U?#26.A3)
DDR_DQ27: Zynq_DDR_Interface (U?#22.Y4), DDR3L_Modules (U?#26.B8)
DDR_DQ28: Zynq_DDR_Interface (U?#22.Y2), DDR3L_Modules (U?#26.C3)
DDR_DQ29: Zynq_DDR_Interface (U?#22.W3), DDR3L_Modules (U?#26.D7)
DDR_DQ30: Zynq_DDR_Interface (U?#22.V2), DDR3L_Modules (U?#26.C2)
DDR_DQ31: Zynq_DDR_Interface (U?#22.V3), DDR3L_Modules (U?#26.A7)
DDR_DQS0_N: Zynq_DDR_Interface (U?#22.B2), DDR3L_Modules (U?#24.B7)
DDR_DQS0_P: Zynq_DDR_Interface (U?#22.C2), DDR3L_Modules (U?#24.C7)
DDR_DQS1_N: Zynq_DDR_Interface (U?#22.F2), DDR3L_Modules (U?#24.G3)
DDR_DQS1_P: Zynq_DDR_Interface (U?#22.G2), DDR3L_Modules (U?#24.F3)
DDR_DQS2_N: Zynq_DDR_Interface (U?#22.T2), DDR3L_Modules (U?#26.G3)
DDR_DQS2_P: Zynq_DDR_Interface (U?#22.R2), DDR3L_Modules (U?#26.F3)
DDR_DQS3_N: Zynq_DDR_Interface (U?#22.W4), DDR3L_Modules (U?#26.B7)
DDR_DQS3_P: Zynq_DDR_Interface (U?#22.W5), DDR3L_Modules (U?#26.C7)
DDR_NCAS: Zynq_DDR_Interface (R?#110.1 U?#22.P5), DDR3L_Modules (U?#24.K3 U?#26.K3)
DDR_NCS: Zynq_DDR_Interface (R?#108.1 U?#22.N1), DDR3L_Modules (U?#24.L2 U?#26.L2)
DDR_NRAS: Zynq_DDR_Interface (R?#109.1 U?#22.P4), DDR3L_Modules (U?#24.J3 U?#26.J3)
DDR_NRST: Zynq_DDR_Interface (R?#131.2 U?#22.B4), DDR3L_Modules (U?#24.T2 U?#26.T2)
DDR_NWE: Zynq_DDR_Interface (R?#111.1 U?#22.M5), DDR3L_Modules (U?#24.L3 U?#26.L3)
DDR_ODT: Zynq_DDR_Interface (R?#130.1 U?#22.N5), DDR3L_Modules (U?#24.K1 U?#26.K1)
ETH_MDC: Zynq_PS_System (U?#16.C10), Gigabit_Ethernet (U?#27.13)
ETH_MDIO: Zynq_PS_System (U?#16.C11), Gigabit_Ethernet (R?#149.1 U?#27.14)
ETH_NINT: Zynq_PS_System (U?#16.E12), Gigabit_Ethernet (R?#151.1 U?#27.31)
ETH_NRST_+3V3: Zynq_PS_System (R?#100.2 U?#19.4), Gigabit_Ethernet (U?#27.12)
ETH_PHY_TXCLK: Zynq_PS_System (R?#92.2), Gigabit_Ethernet (U?#27.20)
ETH_PHY_TXCTL: Zynq_PS_System (R?#97.2), Gigabit_Ethernet (U?#27.19)
ETH_PHY_TXD0: Zynq_PS_System (R?#93.2), Gigabit_Ethernet (U?#27.18)
ETH_PHY_TXD1: Zynq_PS_System (R?#94.2), Gigabit_Ethernet (U?#27.17)
ETH_PHY_TXD2: Zynq_PS_System (R?#95.2), Gigabit_Ethernet (U?#27.16)
ETH_PHY_TXD3: Zynq_PS_System (R?#96.2), Gigabit_Ethernet (U?#27.15)
ETH_RXCLK: Zynq_PS_System (U?#16.B17), Gigabit_Ethernet (R?#145.1 R?#146.2)
ETH_RXCTL: Zynq_PS_System (U?#16.D13), Gigabit_Ethernet (R?#144.1 R?#147.2)
ETH_RXD0: Zynq_PS_System (U?#16.D11), Gigabit_Ethernet (R?#139.2 R?#140.1)
ETH_RXD1: Zynq_PS_System (U?#16.A16), Gigabit_Ethernet (R?#138.2 R?#141.1)
ETH_RXD2: Zynq_PS_System (U?#16.F15), Gigabit_Ethernet (R?#137.2 R?#142.1 R?#148.2)
ETH_RXD3: Zynq_PS_System (U?#16.A15), Gigabit_Ethernet (R?#136.2 R?#143.1)
PG_3V3: Regulators (R?#21.1 R?#33.1 U?#5.5), Zynq_PS_System (U?#15.2)
PL_CLK_125MHZ: Zynq_PL (U?#20.K17), Gigabit_Ethernet (R?#156.1)
QSPI_DQ3_M0: Zynq_JTAG_Programmer (R?#62.1), Zynq_PS_System (U?#14.7 U?#16.A6)
UART1_RX: Zynq_JTAG_Programmer (R?#52.2), Zynq_PS_System (U?#16.B5)
UART1_TX_VCFG1: Zynq_JTAG_Programmer (R?#53.2), Zynq_PS_System (R?#91.1 U?#16.D5)
USB_FTDI_D_N: Input_Power (D?#1.1 J?#1.A7), Zynq_JTAG_Programmer (U?#12.7)
USB_FTDI_D_P: Input_Power (D?#1.2 J?#1.A6), Zynq_JTAG_Programmer (U?#12.8)

## Assembly variants
Assembly_Variant: not fitted R? R?